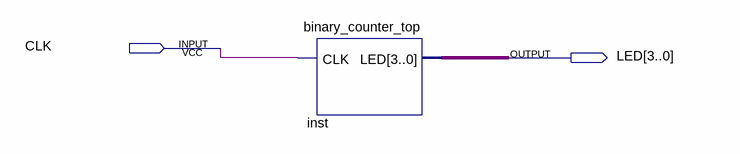
[diagram p0: schematic sheet]
// Quartus schematic Block1.bdf as structural Verilog: 1 symbols, 2 pins
module Block1 (
  input  CLK,
  output [3:0] LED
);

  binary_counter_top inst (.CLK(CLK), .LED(LED));
endmodule
